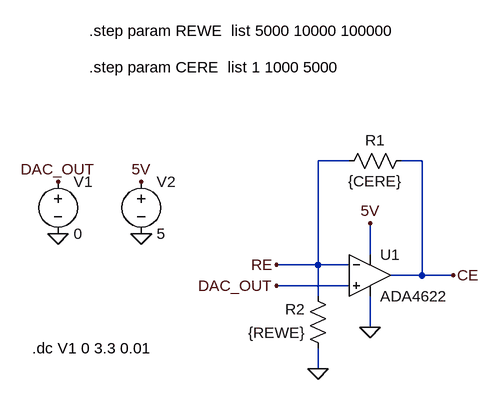
[diagram p0: schematic Control Amp ADA4625.asc]
Control Amp ADA4625.asc, the LTspice schematic file:
Version 4
SHEET 1 880 680
WIRE 176 -48 128 -48
WIRE 288 -48 256 -48
WIRE 208 96 208 48
WIRE 128 112 128 -48
WIRE 128 112 64 112
WIRE 176 112 128 112
WIRE 288 128 288 -48
WIRE 288 128 240 128
WIRE 336 128 288 128
WIRE 176 144 64 144
WIRE 128 160 128 112
WIRE 208 208 208 160
WIRE 128 272 128 240
FLAG 208 208 0
FLAG 208 48 5V
FLAG 336 128 CE
FLAG 64 144 DAC_OUT
FLAG 64 112 RE
FLAG 128 272 0
FLAG -144 64 0
FLAG -272 64 0
FLAG -272 -16 DAC_OUT
FLAG -144 -16 5V
SYMBOL OpAmps\\ADA4622 208 64 R0
SYMATTR InstName U1
SYMBOL res 272 -64 R90
WINDOW 0 0 56 VBottom 2
WINDOW 3 32 56 VTop 2
SYMATTR InstName R1
SYMATTR Value {CERE}
SYMBOL res 144 256 R180
WINDOW 0 36 76 Left 2
WINDOW 3 36 40 Left 2
SYMATTR InstName R2
SYMATTR Value {REWE}
SYMBOL voltage -272 -32 R0
WINDOW 123 0 0 Left 0
WINDOW 39 0 0 Left 0
SYMATTR InstName V1
SYMATTR Value 0
SYMBOL voltage -144 -32 R0
WINDOW 123 0 0 Left 0
WINDOW 39 0 0 Left 0
SYMATTR InstName V2
SYMATTR Value 5
TEXT -312 240 Left 2 !.dc V1 0 3.3 0.01
TEXT -224 -248 Left 2 !.step param REWE  list 5000 10000 100000
TEXT -224 -192 Left 2 !.step param CERE  list 1 1000 5000

The netlist it stands for:
* Control Amp ADA4625.asc
XU1 DAC_OUT RE 5V 0 CE ADA4622  ; pins In+ In- V+ V- OUT
R1 CE RE {CERE}
R2 0 RE {REWE}
V1 DAC_OUT 0 0
V2 5V 0 5
.dc V1 0 3.3 0.01
.step param REWE  list 5000 10000 100000
.step param CERE  list 1 1000 5000
.lib ADA4622.lib
.backanno
.end